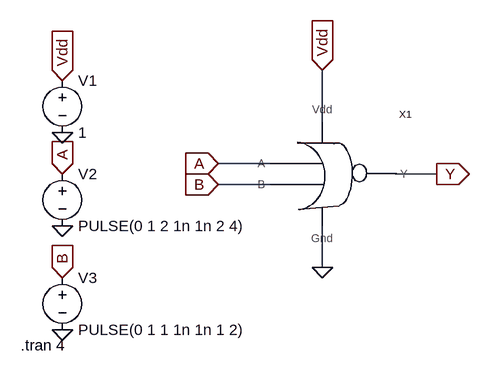
[diagram p0: schematic nor_test.asc]
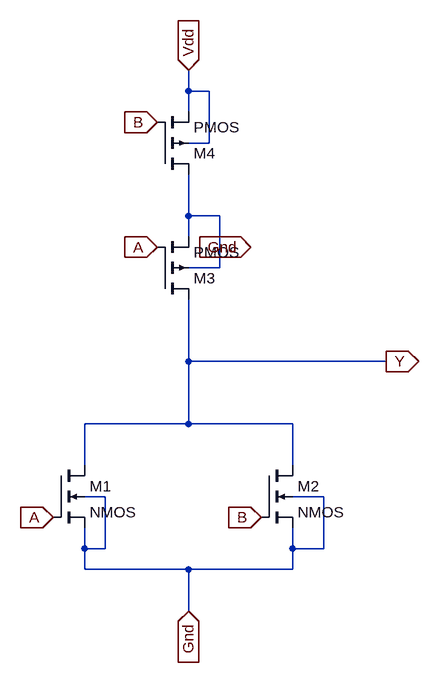
[diagram p1: sub-circuit nor.asc]
nor_test.asc, the LTspice schematic file:
Version 4
SHEET 1 880 680
WIRE 256 96 256 16
WIRE 176 160 96 160
WIRE 432 176 368 176
WIRE 176 192 96 192
WIRE 256 320 256 256
FLAG 96 160 A
IOPIN 96 160 In
FLAG 96 192 B
IOPIN 96 192 In
FLAG 256 16 Vdd
IOPIN 256 16 In
FLAG 432 176 Y
IOPIN 432 176 Out
FLAG 256 320 0
FLAG -144 32 Vdd
IOPIN -144 32 In
FLAG -144 176 A
IOPIN -144 176 In
FLAG -144 336 B
IOPIN -144 336 In
FLAG -144 112 0
FLAG -144 256 0
FLAG -144 416 0
SYMBOL nor 256 160 R0
SYMATTR InstName X1
SYMBOL voltage -144 16 R0
SYMATTR InstName V1
SYMATTR Value 1
SYMBOL voltage -144 160 R0
WINDOW 123 0 0 Left 0
WINDOW 39 0 0 Left 0
SYMATTR InstName V2
SYMATTR Value PULSE(0 1 2 1n 1n 2 4)
SYMBOL voltage -144 320 R0
WINDOW 123 0 0 Left 0
WINDOW 39 0 0 Left 0
SYMATTR InstName V3
SYMATTR Value PULSE(0 1 1 1n 1n 1 2)
TEXT -208 440 Left 2 !.tran 4

nor.asc, the sub-circuit schematic file:
Version 4
SHEET 1 880 760
WIRE -96 -240 -96 -272
WIRE -64 -240 -96 -240
WIRE -96 -208 -96 -240
WIRE -64 -160 -64 -240
WIRE -64 -160 -96 -160
WIRE -96 -48 -96 -112
WIRE -48 -48 -96 -48
WIRE -96 -16 -96 -48
WIRE -48 32 -48 -48
WIRE -48 32 -96 32
WIRE -96 176 -96 80
WIRE 208 176 -96 176
WIRE -96 272 -96 176
WIRE -96 272 -256 272
WIRE 64 272 -96 272
WIRE -256 336 -256 272
WIRE 64 336 64 272
WIRE -224 384 -256 384
WIRE 112 384 64 384
WIRE -256 464 -256 432
WIRE -224 464 -224 384
WIRE -224 464 -256 464
WIRE 64 464 64 432
WIRE 112 464 112 384
WIRE 112 464 64 464
WIRE -256 496 -256 464
WIRE -96 496 -256 496
WIRE 64 496 64 464
WIRE 64 496 -96 496
WIRE -96 560 -96 496
FLAG -96 -272 Vdd
IOPIN -96 -272 In
FLAG -304 416 A
IOPIN -304 416 In
FLAG -144 0 A
IOPIN -144 0 In
FLAG -144 -192 B
IOPIN -144 -192 In
FLAG 16 416 B
IOPIN 16 416 In
FLAG 208 176 Y
IOPIN 208 176 Out
FLAG -96 560 Gnd
IOPIN -96 560 In
FLAG 0 0 Gnd
IOPIN 0 0 In
SYMBOL nmos4 -304 336 R0
SYMATTR InstName M1
SYMBOL nmos4 16 336 R0
SYMATTR InstName M2
SYMBOL pmos4 -144 80 M180
SYMATTR InstName M3
SYMBOL pmos4 -144 -112 M180
SYMATTR InstName M4

The netlist it stands for:
* nor_test.asc
XX1 A B Vdd 0 Y nor
V1 Vdd 0 1
V2 A 0 PULSE(0 1 2 1n 1n 2 4)
V3 B 0 PULSE(0 1 1 1n 1n 1 2)

* block symbol definitions
.subckt nor A B Vdd Gnd Y
M1 Y A Gnd Gnd NMOS
M2 Y B Gnd Gnd NMOS
M3 Y A N001 N001 PMOS
M4 N001 B Vdd Vdd PMOS
.ends nor

.model NMOS NMOS
.model PMOS PMOS
.lib standard.mos
.tran 4
.backanno
.end

* Results of the author's LTspice run, read from the files saved beside the schematic
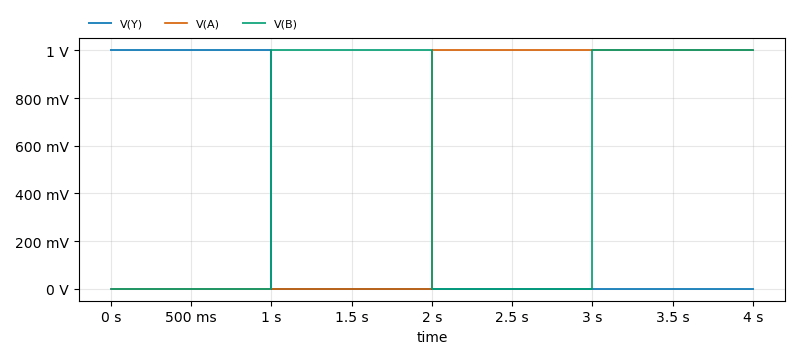
[diagram p2: Transient Analysis of nor_test.asc, plotted from the saved traces]
* Transient Analysis, 1 run:
*   V(Y): min -1.254 µV, max 1 V, average 250 mV, rms 500 mV, last 0 V
*   V(A): min 0 V, max 1 V, average 500 mV, rms 707.1 mV, last 1 V
*   V(B): min 0 V, max 1 V, average 500 mV, rms 707.1 mV, last 1 V